# EAGLE design HexStepTroller_REV2auto (EAGLE 6.2)
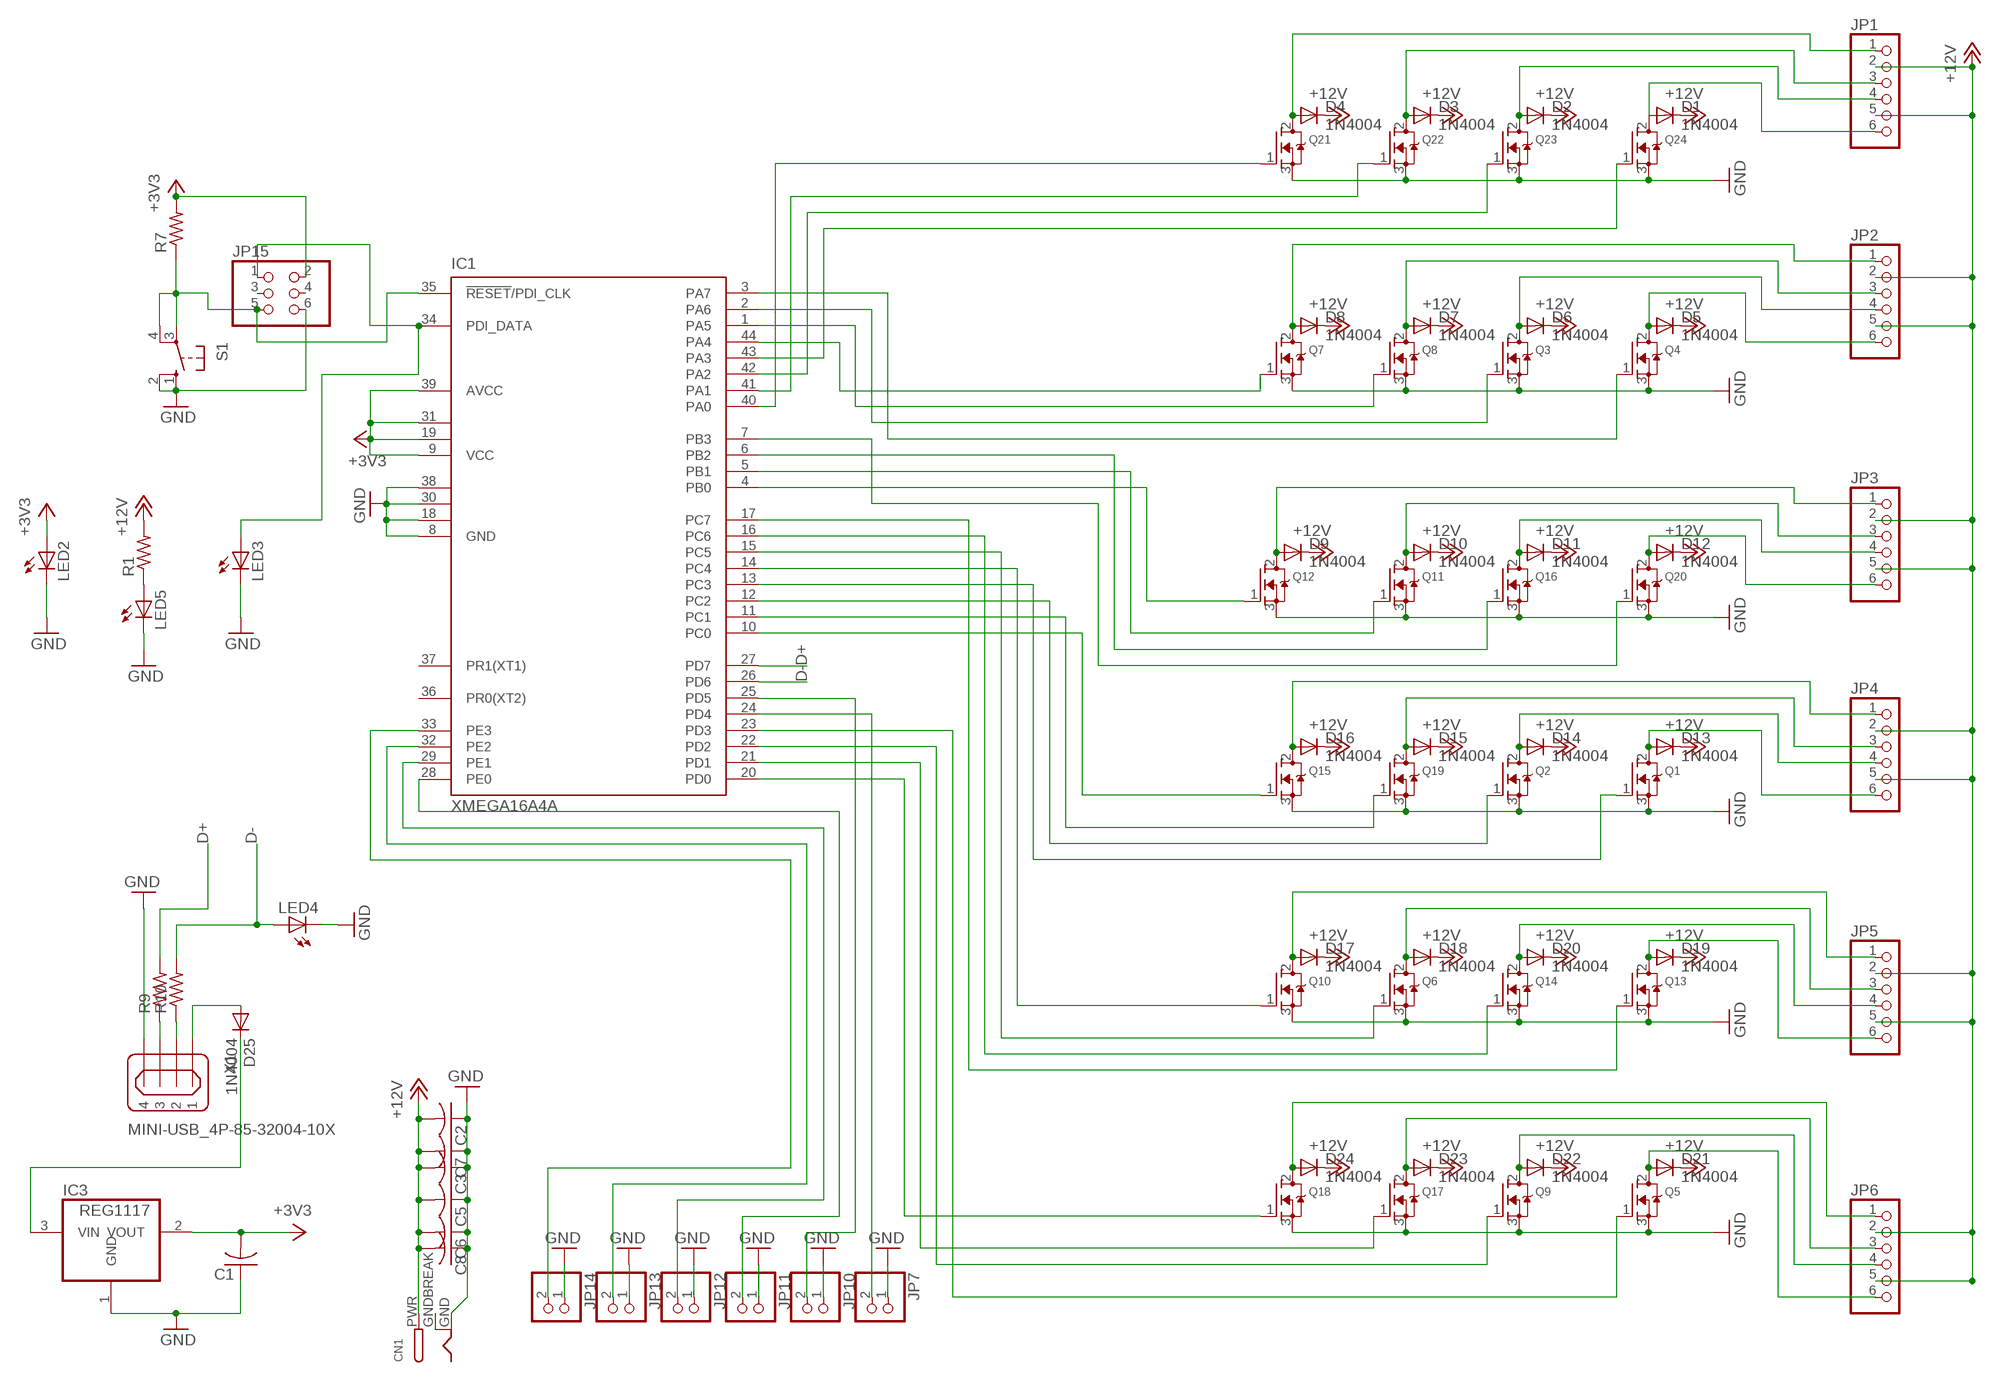
[diagram p0: schematic, sheet 1]

## Parts
C1  C-US050-075X075  [C050-075X075]
C2  C-US050-075X075  [C050-075X075]
C3  C-US050-075X075  [C050-075X075]
C5  C-US050-075X075  [C050-075X075]
C6  C-US050-075X075  [C050-075X075]
C7  C-US050-075X075  [C050-075X075]
C8  C-US050-075X075  [C050-075X075]
CN1  DCBARRELPTH  [DCJACK_2MM_PTH]
D1  1N4004  [DO41-10]
D2  1N4004  [DO41-10]
D3  1N4004  [DO41-10]
D4  1N4004  [DO41-10]
D5  1N4004  [DO41-10]
D6  1N4004  [DO41-10]
D7  1N4004  [DO41-10]
D8  1N4004  [DO41-10]
D9  1N4004  [DO41-10]
D10  1N4004  [DO41-10]
D11  1N4004  [DO41-10]
D12  1N4004  [DO41-10]
D13  1N4004  [DO41-10]
D14  1N4004  [DO41-10]
D15  1N4004  [DO41-10]
D16  1N4004  [DO41-10]
D17  1N4004  [DO41-10]
D18  1N4004  [DO41-10]
D19  1N4004  [DO41-10]
D20  1N4004  [DO41-10]
D21  1N4004  [DO41-10]
D22  1N4004  [DO41-10]
D23  1N4004  [DO41-10]
D24  1N4004  [DO41-10]
D25  1N4004  [DO41-10]
IC1  XMEGA16A4A  [TQFP44]
IC3  REG1117  [SOT223]
JP1  PINHD-1X6  [1X06]
JP2  PINHD-1X6  [1X06]
JP3  PINHD-1X6  [1X06]
JP4  PINHD-1X6  [1X06]
JP5  PINHD-1X6  [1X06]
JP6  PINHD-1X6  [1X06]
JP7  PINHD-1X2  [1X02]
JP10  PINHD-1X2  [1X02]
JP11  PINHD-1X2  [1X02]
JP12  PINHD-1X2  [1X02]
JP13  PINHD-1X2  [1X02]
JP14  PINHD-1X2  [1X02]
JP15  PINHD-2X3  [2X03]
LED2  LED5MM  [LED5MM]
LED3  LED5MM  [LED5MM]
LED4  LED5MM  [LED5MM]
LED5  LED5MM  [LED5MM]
Q1  MOSFET-NGDS_TO220V  [TO220V]
Q2  MOSFET-NGDS_TO220V  [TO220V]
Q3  MOSFET-NGDS_TO220V  [TO220V]
Q4  MOSFET-NGDS_TO220V  [TO220V]
Q5  MOSFET-NGDS_TO220V  [TO220V]
Q6  MOSFET-NGDS_TO220V  [TO220V]
Q7  MOSFET-NGDS_TO220V  [TO220V]
Q8  MOSFET-NGDS_TO220V  [TO220V]
Q9  MOSFET-NGDS_TO220V  [TO220V]
Q10  MOSFET-NGDS_TO220V  [TO220V]
Q11  MOSFET-NGDS_TO220V  [TO220V]
Q12  MOSFET-NGDS_TO220V  [TO220V]
Q13  MOSFET-NGDS_TO220V  [TO220V]
Q14  MOSFET-NGDS_TO220V  [TO220V]
Q15  MOSFET-NGDS_TO220V  [TO220V]
Q16  MOSFET-NGDS_TO220V  [TO220V]
Q17  MOSFET-NGDS_TO220V  [TO220V]
Q18  MOSFET-NGDS_TO220V  [TO220V]
Q19  MOSFET-NGDS_TO220V  [TO220V]
Q20  MOSFET-NGDS_TO220V  [TO220V]
Q21  MOSFET-NGDS_TO220V  [TO220V]
Q22  MOSFET-NGDS_TO220V  [TO220V]
Q23  MOSFET-NGDS_TO220V  [TO220V]
Q24  MOSFET-NGDS_TO220V  [TO220V]
R1  R-US_0204/7  [0204/7]
R7  R-US_0204/7  [0204/7]
R9  R-US_0204/7  [0204/7]
R10  R-US_0204/7  [0204/7]
S1  10-XX  [B3F-10XX]
X1  MINI-USB_4P-85-32004-10X  [85-32004-10X]

## Nets
+3V3: C1.2 IC1.9(VCC) IC1.19(VCC1) IC1.31(VCC2) IC1.39(AVCC) IC3.2(VOUT) JP15.2 LED2.A R7.2
+12V: C2.2 C3.2 C5.2 C6.2 C7.2 C8.2 CN1.PWR D1.C D2.C D3.C D4.C D5.C D6.C D7.C D8.C D9.C D10.C D11.C D12.C D13.C D14.C D15.C D16.C D17.C D18.C D19.C D20.C D21.C D22.C D23.C D24.C JP1.2 JP1.5 JP2.2 JP2.5 JP3.2 JP3.5 JP4.2 JP4.5 JP5.2 JP5.5 JP6.2 JP6.5 R1.2
D+: IC1.27(PD7) R9.2
D-: IC1.26(PD6) LED4.A R10.2
GND: C1.1 C2.1 C3.1 C5.1 C6.1 C7.1 C8.1 CN1.GND IC1.8(GND) IC1.18(GND1) IC1.30(GND2) IC1.38(GND3) IC3.1(GND) JP7.1 JP10.1 JP11.1 JP12.1 JP13.1 JP14.1 JP15.6 LED2.K(C) LED3.K(C) LED4.K(C) LED5.K(C) Q1.3(S) Q2.3(S) Q3.3(S) Q4.3(S) Q5.3(S) Q6.3(S) Q7.3(S) Q8.3(S) Q9.3(S) Q10.3(S) Q11.3(S) Q12.3(S) Q13.3(S) Q14.3(S) Q15.3(S) Q16.3(S) Q17.3(S) Q18.3(S) Q19.3(S) Q20.3(S) Q21.3(S) Q22.3(S) Q23.3(S) Q24.3(S) S1.1(S) S1.2(S1) X1.4
N$1: D1.A JP1.6 Q24.2(D)
N$2: D2.A JP1.4 Q23.2(D)
N$3: D3.A JP1.3 Q22.2(D)
N$4: D4.A JP1.1 Q21.2(D)
N$5: D5.A JP2.6 Q4.2(D)
N$6: D6.A JP2.4 Q3.2(D)
N$7: D7.A JP2.3 Q8.2(D)
N$8: D8.A JP2.1 Q7.2(D)
N$9: D9.A JP3.1 Q12.2(D)
N$10: D10.A JP3.3 Q11.2(D)
N$11: D11.A JP3.4 Q16.2(D)
N$12: D12.A JP3.6 Q20.2(D)
N$13: D13.A JP4.6 Q1.2(D)
N$14: D14.A JP4.4 Q2.2(D)
N$15: D15.A JP4.3 Q19.2(D)
N$16: D16.A JP4.1 Q15.2(D)
N$17: D17.A JP5.1 Q10.2(D)
N$18: D18.A JP5.3 Q6.2(D)
N$19: D19.A JP5.6 Q13.2(D)
N$20: D20.A JP5.4 Q14.2(D)
N$21: D21.A JP6.6 Q5.2(D)
N$22: D22.A JP6.4 Q9.2(D)
N$23: D23.A JP6.3 Q17.2(D)
N$24: D24.A JP6.1 Q18.2(D)
N$25: IC1.44(PA4) Q7.1(G)
N$26: IC1.25(PD5) JP10.2
N$27: IC1.28(PE0) JP11.2
N$28: LED5.A R1.1
N$29: IC1.32(PE2) JP13.2
N$30: IC1.33(PE3) JP14.2
N$32: IC1.35(!RESET!/PDI_CLK) JP15.5 R7.1 S1.3(P) S1.4(P1)
N$33: D25.C IC3.3(VIN)
N$34: R9.1 X1.3
N$35: D25.A X1.1
N$36: IC1.34(PDI_DATA) JP15.1 LED3.A
N$40: IC1.24(PD4) JP7.2
N$41: IC1.29(PE1) JP12.2
N$42: R10.1 X1.2
N$49: IC1.40(PA0) Q21.1(G)
N$50: IC1.41(PA1) Q22.1(G)
N$51: IC1.42(PA2) Q23.1(G)
N$52: IC1.43(PA3) Q24.1(G)
N$54: IC1.1(PA5) Q8.1(G)
N$55: IC1.2(PA6) Q3.1(G)
N$56: IC1.3(PA7) Q4.1(G)
N$57: IC1.4(PB0) Q12.1(G)
N$58: IC1.5(PB1) Q11.1(G)
N$59: IC1.6(PB2) Q16.1(G)
N$60: IC1.7(PB3) Q20.1(G)
N$61: IC1.10(PC0) Q15.1(G)
N$62: IC1.11(PC1) Q19.1(G)
N$63: IC1.12(PC2) Q2.1(G)
N$64: IC1.13(PC3) Q1.1(G)
N$65: IC1.14(PC4) Q10.1(G)
N$66: IC1.15(PC5) Q6.1(G)
N$67: IC1.16(PC6) Q14.1(G)
N$68: IC1.17(PC7) Q13.1(G)
N$69: IC1.20(PD0) Q18.1(G)
N$70: IC1.21(PD1) Q17.1(G)
N$71: IC1.22(PD2) Q9.1(G)
N$72: IC1.23(PD3) Q5.1(G)
Unconnected: IC1.36(PR0(XT2)) IC1.37(PR1(XT1)) JP15.3 JP15.4

## Power pins joined to a net without a drawn wire
GNDBREAK: CN1.GNDBREAK

## Library data of the parts
C1-C3 C5-C8 = resistor:C-US: CAPACITOR, American symbol
CN1 = adafruit:DCBARREL: 2.0mm DC Barrel Jack DCJACK_2MM_PTH - Through Hole Jack (4UConnector: 05537)
D1-D25 = adafruit:1N4004: DIODE General purpose 1N400x type rectifier (With bigger pads) http://www.ladyada.net/library/pcb/eaglelibrary.html
IC1 = atmel:XMEGA16A4: MICROCONTROLLER Features High-performance, Low-power 8/16-bit AVR XMEGA Microcontroller Non-Volatile Program and Data Memories - 16 KB - 128 KB of In-System Self-Programmable Flash - 4 KB - 8 KB Boot Code Section with Independent Lock Bits - 1 KB - 2 KB EEPROM - 2 KB - 8 KB Internal SRAM Peripheral Features - Four-channel DMA Controller with support for external requests - Eight-channel Event System - Five 16-bit Timer/Counters Three Timer/Counters with 4 Output Compare or Input Capture channels Two Timer/Counters with 2 Output Compare or Input Capture channels High-Resolution Extensions on all Timer/Counters Advanced Waveform Extension on one Timer/Counter - Five USARTs IrDA Extension on one USART - Two Two-Wire Interfaces with dual address match (I2C and SMBus compatible) - Two SPIs (Serial Peripheral Interfaces) peripherals - AES and DES Crypto Engine - 16-bit Real Time Counter with Separate Oscillator - One Twelve-channel, 12-bit, 2 Msps Analog to Digital Converter - One Two-channel, 12-bit, 1 Msps Digital to Analog Converter - Two Analog Comparators with Window compare function - External Interrupts on all General Purpose I/O pins - Programmable Watchdog Timer with Separate On-chip Ultra Low Power Oscillator Special Microcontroller Features - Power-on Reset and Programmable Brown-out Detection - Internal and External Clock Options with PLL - Programmable Multi-level Interrupt Controller - Sleep Modes: Idle, Power-down, Standby, Power-save, Extended Standby - Advanced Programming, Test and Debugging Interfaces PDI (Program and Debug Interface) for programming, test and debugging I/O and Packages - 34 Programmable I/O Lines - 44 - lead TQFP - 44 - pad VQFN/QFN - 49 - ball VFBGA Operating Voltage - 1.6 - 3.6V Speed performance - 0 - 12 MHz @ 1.6 - 3.6V - 0 - 32 MHz @ 2.7 - 3.6V Drawn by Dipl.-Ing. (FH) Robert Siegler Created: 27.05.09; OC_FARNELL: unknown; OC_NEWARK: unknown
IC3 = burr-brown:REG1117: 800mA and 1A Low Dropout (LDO) Positive Regulator 1.8V, 2.5V, 2.85V, 3.3V, 5V, and Adj; MPN: REG1117; OC_FARNELL: 1097566; OC_NEWARK: 14P6981
JP1-JP6 = pinhead:PINHD-1X6: PIN HEADER
JP7 JP10-JP14 = pinhead:PINHD-1X2: PIN HEADER
JP15 = pinhead:PINHD-2X3: PIN HEADER
LED2-LED5 = adafruit:LED: LED OSRAM: - CHIPLED LG R971, LG N971, LY N971, LG Q971, LY Q971, LO R971, LY R971 LH N974, LH R974 LS Q976, LO Q976, LY Q976 LO Q996 - Hyper CHIPLED LW Q18S LB Q993, LB Q99A, LB R99A - SideLED LS A670, LO A670, LY A670, LG A670, LP A670 LB A673, LV A673, LT A673, LW A673 LH A674 LY A675 LS A676, LA A676, LO A676, LY A676, LW A676 LS A679, LY A679, LG A679 - Hyper Micro SIDELED® LS Y876, LA Y876, LO Y876, LY Y876 LT Y87S - SmartLED LW L88C, LW L88S LB L89C, LB L89S, LG L890 LS L89K, LO L89K, LY L89K LS L896, LA L896, LO L896, LY L896 - TOPLED LS T670, LO T670, LY T670, LG T670, LP T670 LSG T670, LSP T670, LSY T670, LOP T670, LYG T670 LG T671, LOG T671, LSG T671 LB T673, LV T673, LT T673, LW T673 LH T674 LS T676, LA T676, LO T676, LY T676, LB T676, LH T676, LSB T676, LW T676 LB T67C, LV T67C, LT T67C, LS T67K, LO T67K, LY T67K, LW E67C LS E67B, LA E67B, LO E67B, LY E67B, LB E67C, LV E67C, LT E67C LW T67C LS T679, LY T679, LG T679 LS T770, LO T770, LY T770, LG T770, LP T770 LB T773, LV T773, LT T773, LW T773 LH T774 LS E675, LA E675, LY E675, LS T675 LS T776, LA T776, LO T776, LY T776, LB T776 LHGB T686 LT T68C, LB T68C - Hyper Mini TOPLED® LB M676 - Mini TOPLED Santana® LG M470 LS M47K, LO M47K, LY M47K Source: http://www.osram.convergy.de/
Q1-Q24 = adafruit:MOSFET-N: N-Channel Mosfet 2N7002E - 60V 260mA SOT23 [Digikey: 2N7002ET1GOSTR-ND] - REEL BSH103 - 30V 850mA SOT23 [Digikey: 568-5013-1-ND]
R1 R7 R9 R10 = resistor:R-US_: RESISTOR, American symbol
S1 = switch-omron:10-XX: OMRON SWITCH; MPN: B3F-1000; OC_FARNELL: 176432; OC_NEWARK: 36M3542
X1 = con-cypressindustries:MINI-USB_4P-: MINI USB 4 Pol. Source: www.cypressindustries.com; OC_FARNELL: unknown; OC_NEWARK: unknown

## Net classes
0 default: width 0.305 mm, drill 0.508 mm, clearance 0.254 mm
1 power: width 0.61 mm, drill 0.508 mm, clearance 0.254 mm

## Board
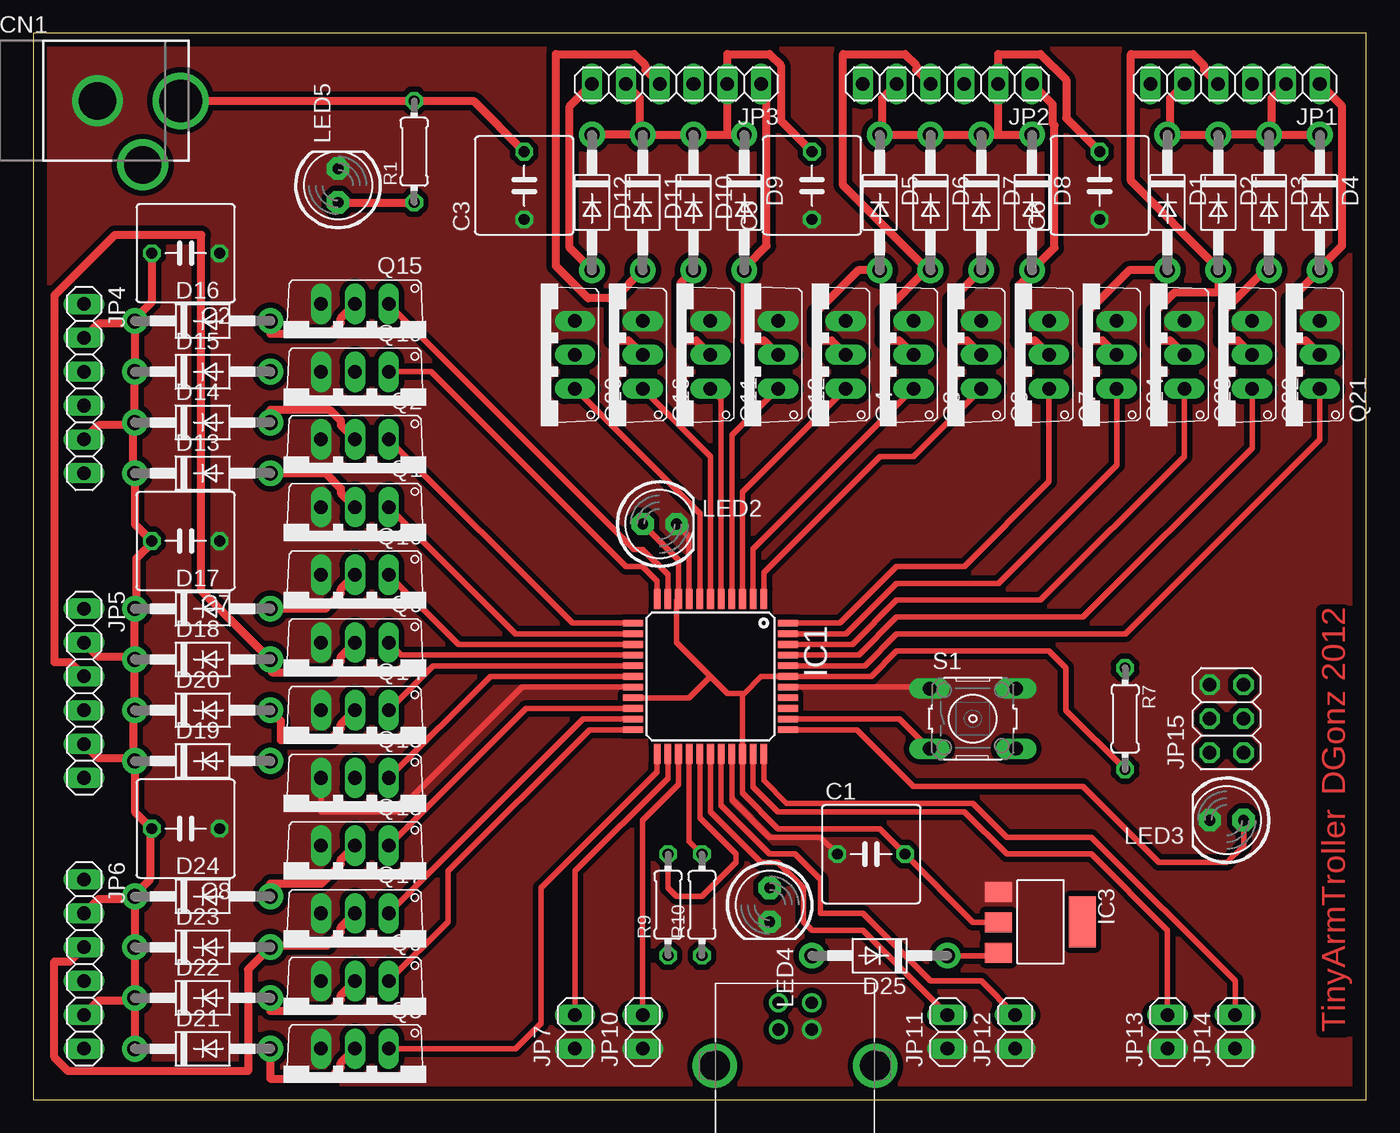
[diagram p1: board, top side]
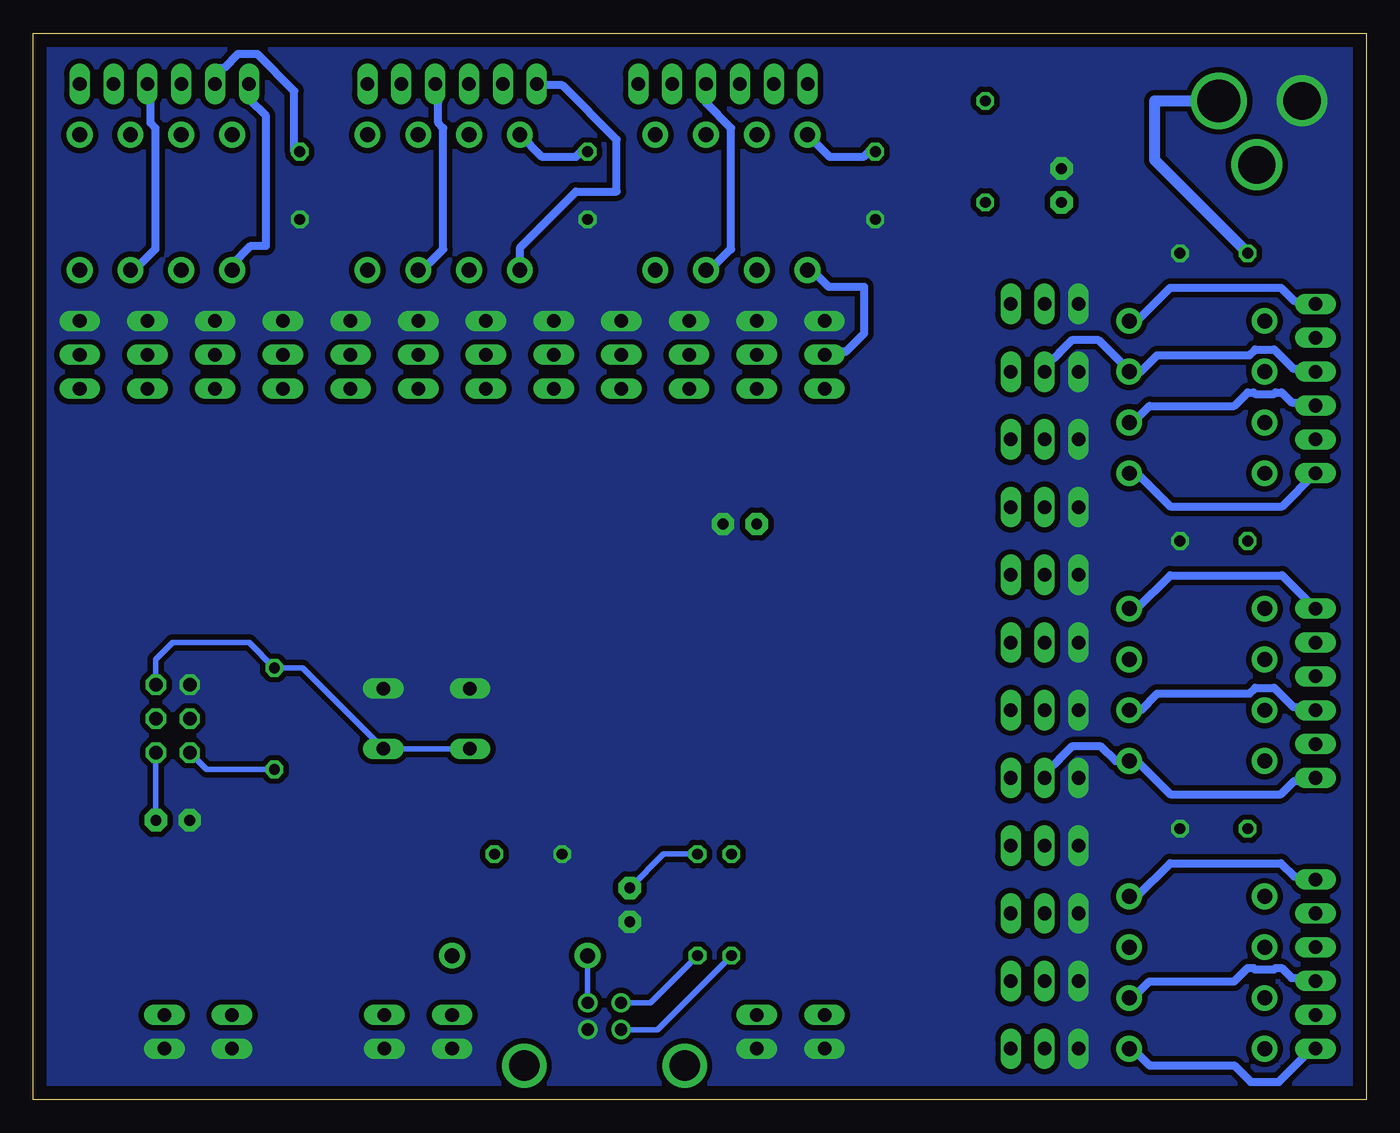
[diagram p2: board, bottom side, seen from below]

Size 100 x 80 mm. Coordinates in mm from the lower left corner, seen from the top.
Outline: 0,0 100,0 100,80 0,80 0,0
Copper layers (1*16): Top 0.035mm / dielectric 1.5mm / Bottom 0.035mm
Design rules: minimum track width 24mil, minimum drill 24mil, track to track 16mil, track to pad 16mil, pad to pad 16mil, via to via 16mil, smd to smd 12mil, copper to edge 40mil, drill to drill 12mil, minimum pad ring 10mil, minimum via ring 8mil, stop-mask expansion 4mil, vias tented up to drill 0mil, thermal gap 12mil

### Footprints (pad centres in the part's own frame; a part is rotated, then mirrored left to right if it is on the bottom)
C050-075X075 = drill 0.813 octagon: 1 -2.54,0; 2 2.54,0
DCJACK_2MM_PTH = drill 2.8: GND 0,7.35; GNDBREAK 4.8,10.75 | drill 3.2: PWR 0,13.6
DO41-10 = drill 1.118 pad 1.93: A 5.08,0; C -5.08,0
TQFP44 = smd 1.5 x 0.5: 1 -5.8,4; 2 -5.8,3.2; 3 -5.8,2.4; 4 -5.8,1.6; 5 -5.8,0.8; 6 -5.8,0; 7 -5.8,-0.8; 8 -5.8,-1.6; 9 -5.8,-2.4; 10 -5.8,-3.2; 11 -5.8,-4; 23 5.8,-4; 24 5.8,-3.2; 25 5.8,-2.4; 26 5.8,-1.6; 27 5.8,-0.8; 28 5.8,0; 29 5.8,0.8; 30 5.8,1.6; 31 5.8,2.4; 32 5.8,3.2; 33 5.8,4 | smd 0.5 x 1.5: 12 -4,-5.8; 13 -3.2,-5.8; 14 -2.4,-5.8; 15 -1.6,-5.8; 16 -0.8,-5.8; 17 0,-5.8; 18 0.8,-5.8; 19 1.6,-5.8; 20 2.4,-5.8; 21 3.2,-5.8; 22 4,-5.8; 34 4,5.8; 35 3.2,5.8; 36 2.4,5.8; 37 1.6,5.8; 38 0.8,5.8; 39 0,5.8; 40 -0.8,5.8; 41 -1.6,5.8; 42 -2.4,5.8; 43 -3.2,5.8; 44 -4,5.8
SOT223 = smd 1.499 x 2.007: 1 -2.261,-3.15; 2 0.025,-3.15; 3 2.311,-3.15 | smd 3.81 x 2.007: 4 0,3.15
1X06 = drill 1.016 long: 1 -6.35,0; 2 -3.81,0; 3 -1.27,0; 4 1.27,0; 5 3.81,0; 6 6.35,0
1X02 = drill 1.016 long: 1 -1.27,0; 2 1.27,0
2X03 = drill 1.016 octagon: 1 -2.54,-1.27; 2 -2.54,1.27; 3 0,-1.27; 4 0,1.27; 5 2.54,-1.27; 6 2.54,1.27
LED5MM = drill 0.813 pad 1.676 octagon: A -1.27,0; K 1.27,0
TO220V = drill 1.016 long: 1 -2.54,-2.54; 2 0,-2.54; 3 2.54,-2.54
0204/7 = drill 0.813 octagon: 1 -3.81,0; 2 3.81,0
B3F-10XX = drill 1.016 long: 1 -3.251,2.261; 2 3.251,2.261; 3 -3.251,-2.261; 4 3.251,-2.261
85-32004-10X = drill 0.92 pad 1.27: 1 4.71,-1.25; 2 4.71,1.25; 3 2.71,1.25; 4 2.71,-1.25 | drill 2.3 pad 3: M1 0,6.02; M2 0,-6.02

### Placement (x,y rotation side)
C1  62.87,18.41 0 top
C2  11.43,63.5 180 top
C3  36.83,68.58 90 top
C5  58.42,68.58 90 top
C6  80.01,68.58 90 top
C7  11.43,41.91 180 top
C8  11.43,20.32 180 top
CN1  -2.54,74.93 270 top
D1  85.09,67.31 270 top
D2  88.9,67.31 270 top
D3  92.71,67.31 270 top
D4  96.52,67.31 270 top
D5  63.5,67.31 270 top
D6  67.31,67.31 270 top
D7  71.12,67.31 270 top
D8  74.93,67.31 270 top
D9  53.34,67.31 270 top
D10  49.53,67.31 270 top
D11  45.72,67.31 270 top
D12  41.91,67.31 270 top
D13  12.7,46.99 0 top
D14  12.7,50.8 0 top
D15  12.7,54.61 0 top
D16  12.7,58.42 0 top
D17  12.7,36.83 0 top
D18  12.7,33.02 0 top
D19  12.7,25.4 0 top
D20  12.7,29.21 0 top
D21  12.7,3.81 0 top
D22  12.7,7.62 0 top
D23  12.7,11.43 0 top
D24  12.7,15.24 0 top
D25  63.5,10.79 180 top
IC1  50.8,31.75 270 top
IC3  75.56,13.34 270 top
JP1  90.17,76.2 180 top
JP2  68.58,76.2 180 top
JP3  48.26,76.2 180 top
JP4  3.81,53.34 270 top
JP5  3.81,30.48 270 top
JP6  3.81,10.16 270 top
JP7  40.64,5.08 90 top
JP10  45.72,5.08 90 top
JP11  68.58,5.08 90 top
JP12  73.66,5.08 90 top
JP13  85.09,5.08 90 top
JP14  90.17,5.08 90 top
JP15  89.53,28.57 90 top
LED2  46.99,43.18 0 top
LED3  89.53,20.95 180 top
LED4  55.24,14.61 270 top
LED5  22.86,68.58 90 top
Q1  24.13,41.91 180 top
Q2  24.13,46.99 180 top
Q3  63.5,55.88 90 top
Q4  58.42,55.88 90 top
Q5  24.13,1.27 180 top
Q6  24.13,31.75 180 top
Q7  73.66,55.88 90 top
Q8  68.58,55.88 90 top
Q9  24.13,6.35 180 top
Q10  24.13,36.83 180 top
Q11  48.26,55.88 90 top
Q12  53.34,55.88 90 top
Q13  24.13,21.59 180 top
Q14  24.13,26.67 180 top
Q15  24.13,57.15 180 top
Q16  43.18,55.88 90 top
Q17  24.13,11.43 180 top
Q18  24.13,16.51 180 top
Q19  24.13,52.07 180 top
Q20  38.1,55.88 90 top
Q21  93.98,55.88 90 top
Q22  88.9,55.88 90 top
Q23  83.82,55.88 90 top
Q24  78.74,55.88 90 top
R1  28.57,71.12 90 top
R7  81.92,28.57 270 top
R9  47.62,14.61 90 top
R10  50.16,14.61 90 top
S1  70.48,28.57 0 top
X1  57.15,2.54 90 top

### Tracks (layer width: path | path; a pad name or v marks a point on that pad's centre or on a via)
+3V3
  Top 0.406: IC3.2 70.51,13.31 C1.2 63.5,20.32 55.88,20.32 53.2,23 IC1.31 53.2,30.34 53.34,30.48 | 53.34,30.48 54.61,31.75 IC1.39 62.87,31.75 64.77,33.66 76.2,33.66 77.47,32.38 77.47,29.21 R7.2 | 53.34,30.48 52.07,30.48 50.8,31.75 | 50.8,31.75 48.26,34.29 48.26,37.41 IC1.9 48.4,40.5 LED2.A | IC1.19 49.2,30.15 50.8,31.75
  Bottom 0.406: JP15.2 87,24.77 R7.2
+12V
  Top 0.61: JP4.2 4.88,58.22 7.62,58.22 D16.C | D16.C D15.C D14.C | JP4.5 4.88,50.6 7.62,50.6 D14.C | D14.C 7.49,50.32 7.49,47.27 D13.C 7.62,43.18 C7.2 8.76,41.63 7.75,40.62 7.75,37.11 D17.C D18.C | JP6.5 4.88,7.42 7.62,7.42 D22.C | D22.C D21.C | JP6.2 4.88,15.04 7.62,15.04 D24.C | D24.C D23.C D22.C | JP5.2 4.88,33.22 7.62,33.22 D18.C | D19.C 7.62,21.59 C8.2 8.76,20.04 8.76,16.54 7.75,15.52 D24.C | JP5.5 4.88,25.6 7.42,25.6 D19.C | D19.C 7.54,25.88 7.54,29.13 D20.C D18.C | JP1.5 85.29,75.13 85.29,72.59 D1.C D2.C D3.C | JP1.2 92.91,75.13 92.91,72.59 D3.C | D3.C D4.C | C6.2 77.5,73.64 77.5,76.5 75.56,78.44 72.39,78.44 JP2.2 72.39,72.39 | JP2.5 63.7,75.13 63.7,72.59 D5.C D6.C D7.C 72.39,72.39 | 72.39,72.39 D8.C | C5.2 56.08,73.46 56.08,77.6 55.24,78.44 52.07,78.44 JP3.2 52.07,72.39 | JP3.5 45.52,75.13 45.52,72.59 D11.C | D12.C 45.24,72.39 45.24,72.47 D11.C | D11.C D10.C 52.07,72.39 | 52.07,72.39 D9.C | C3.2 33.02,74.93 R1.2 CN1.PWR | C2.2 8.89,59.84 7.75,58.7 D16.C
  Bottom 0.61: JP1.5 86.36,77.39 85.7,77.39 84.66,78.44 83.19,78.44 80.42,75.67 80.42,71.12 C6.2 | D12.C 40.23,70.71 37.72,70.71 37.31,71.12 C3.2 | D5.C 61.82,70.71 59.31,70.71 58.9,71.12 C5.2
  Bottom 0.813: C2.2 15.88,70.48 15.88,74.93 CN1.PWR
D+
  Top 0.406: IC1.27 50,21.12 52.7,18.41 52.7,17.78 50.16,15.24 48.26,15.24 47.62,15.88 R9.2
D-
  Top 0.406: IC1.26 49.2,19.38 R10.2
  Bottom 0.406: LED4.A 52.7,18.41 R10.2
GND
  Top 0.406: IC1.8 49.2,42.24 LED2.K | IC1.38 67.12,30.95 S1.1 | IC1.18 36.66,30.95 27.3,21.59 21.59,21.59 Q13.3 | IC1.30 52.4,22.53 55.24,19.68 59.05,19.68 C1.1
  pour Bottom (no thermals): 0,80.01 100.33,80.01 100.33,0 0,0
  pour Top (no thermals): 0,80.01 100.33,80.01 100.33,0 0,0
N$1
  Top 0.61: Q24.2 80.21,56.95 79.05,56.95 79.05,59.05 82.22,62.23 D1.A
  Bottom 0.61: JP1.6 83.82,74.98 83.72,74.98 82.55,73.81 82.55,64.06 83.69,64.06 85.09,62.66 D1.A
N$2
  Top 0.61: Q23.2 85.29,56.95 84.12,56.95 84.12,59.05 85.62,60.55 88.9,60.55 D2.A 88.77,62.51 82.35,68.94 82.35,78.44 87,78.44 87.83,77.6 87.83,77.27 JP1.4
N$3
  Top 0.61: Q22.2 90.37,56.95 89.2,56.95 89.2,59.05 92.38,62.23 D3.A
  Bottom 0.61: JP1.3 91.44,74.98 91.34,74.98 91.21,74.85 91.21,73.28 90.83,72.9 90.83,63.8 90.86,63.8 92.43,62.23 D3.A
N$4
  Top 0.61: Q21.2 95.45,56.95 94.28,56.95 94.28,59.99 D4.A 96.65,62.51 98.2,64.06 98.2,74.52 JP1.1
N$5
  Top 0.61: Q4.2 59.89,56.95 58.73,56.95 58.73,59.05 61.9,62.23 D5.A
  Bottom 0.61: JP2.6 62.13,76.1 60.3,76.1 56.24,72.03 56.24,68.12 59.28,68.12 63.48,63.93 63.48,62.23 D5.A
N$6
  Top 0.61: Q3.2 64.97,56.95 63.8,56.95 63.8,59.05 66.98,62.23 D6.A 66.85,62.51 60.76,68.61 60.76,78.44 65.41,78.44 66.24,77.6 66.24,77.27 JP2.4
N$7
  Top 0.61: Q8.2 70.05,56.95 68.89,56.95 68.89,59.99 D7.A
  Bottom 0.61: JP2.3 69.85,74.98 69.75,74.98 69.62,74.85 69.62,73.28 69.24,72.9 69.24,63.8 69.27,63.8 70.84,62.23 D7.A
N$8
  Top 0.61: JP2.1 76.48,74.65 76.48,73.23 76.61,73.1 76.61,63.91 D8.A 74.8,61.95 73.97,61.11 73.97,56.95 75.13,56.95 Q7.2
N$9
  Top 0.61: Q12.2 54.81,56.95 53.34,56.95 D9.A 53.47,62.51 55.02,64.06 55.02,75.79 JP3.1
N$10
  Top 0.61: Q11.2 49.73,56.95 48.56,56.95 48.56,61.27 D10.A
  Bottom 0.61: JP3.3 49.53,74.75 49.51,74.75 47.65,72.9 47.65,63.8 47.68,63.8 49.25,62.23 D10.A
N$11
  Top 0.61: Q16.2 44.65,56.95 43.48,56.95 43.48,59.99 | D11.A 43.48,59.99 | JP3.4 45.92,77.27 45.92,77.6 45.09,78.44 39.22,78.44 39.22,62.53 41.63,60.12 43.2,60.12 43.48,59.99
N$12
  Top 0.61: JP3.6 40.23,74.52 40.23,63.91 D12.A
  Bottom 0.61: Q20.2 40.41,56.11 39.04,56.11 37.67,57.48 37.67,60.98 40.34,60.98 41.58,62.23 D12.A
N$13
  Top 0.61: Q1.2 23.06,45.52 23.06,45.85 21.92,46.99 D13.A
  Bottom 0.61: JP4.6 6.3,44.5 14.71,44.5 17.2,46.99 D13.A
N$14
  Top 0.61: Q2.2 23.06,50.6 23.06,50.93 22.23,51.77 17.78,51.77 D14.A
  Bottom 0.61: JP4.4 4.04,52.3 5.59,52.3 6.35,53.06 6.78,53.06 6.91,52.93 8.33,52.93 8.46,53.06 8.89,53.06 9.91,52.05 16.26,52.05 17.5,50.8 D14.A
N$15
  Bottom 0.61: JP4.3 4.04,54.84 5.46,54.84 6.91,56.29 8.33,56.29 8.76,55.85 15.67,55.85 16.92,54.61 D15.A 17.93,54.86 17.96,54.86 20.07,56.97 22.1,56.97 22.99,56.08 22.99,56.03 23.42,55.6 24.13,55.6 Q19.2
N$16
  Top 0.61: Q15.2 23.06,58.62 23.06,58.29 22.23,57.45 17.78,57.45 D16.A
  Bottom 0.61: JP4.1 4.04,59.92 5.41,59.92 6.4,60.91 14.71,60.91 17.2,58.42 D16.A
N$17
  Top 0.61: Q10.2 23.06,38.3 23.06,37.97 21.92,36.83 D17.A
  Bottom 0.61: JP5.1 6.3,39.32 14.71,39.32 17.2,36.83 D17.A
N$18
  Top 0.61: JP5.3 2.74,32.82 1.57,32.82 1.57,60.33 6.12,64.87 12.6,64.87 12.6,38.2 D18.A 17.91,32.74 17.91,32.05 22.23,32.05 23.06,32.89 23.06,33.22 Q6.2
N$19
  Bottom 0.61: JP5.6 4.04,23.9 5.41,23.9 6.4,22.91 14.71,22.91 17.2,25.4 D19.A 18.8,25.4 19.89,26.49 22.1,26.49 22.99,25.6 22.99,25.55 23.42,25.12 24.13,25.12 Q13.2
N$20
  Top 0.61: Q14.2 23.06,28.14 23.06,27.81 22.23,26.98 18.57,26.98 18.57,28.42 D20.A
  Bottom 0.61: JP5.4 4.04,29.44 5.46,29.44 6.91,30.89 8.33,30.89 8.76,30.45 15.67,30.45 16.92,29.21 D20.A
N$21
  Top 0.61: Q5.2 23.06,2.74 23.06,2.41 22.23,1.57 17.78,1.57 D21.A
  Bottom 0.61: JP6.6 4.27,3.35 4.52,3.35 6.55,1.32 8.66,1.32 9.91,2.56 16.26,2.56 17.5,3.81 D21.A
N$22
  Top 0.61: Q9.2 23.06,7.82 23.06,7.49 22.23,6.66 17.78,6.66 D22.A
  Bottom 0.61: JP6.4 4.04,9.12 5.59,9.12 6.35,9.88 6.78,9.88 6.91,9.75 8.33,9.75 8.46,9.88 8.89,9.88 9.91,8.87 16.26,8.87 17.5,7.62 D22.A
N$23
  Top 0.61: JP6.3 2.74,10.36 1.57,10.36 1.57,3.17 2.62,2.13 16.1,2.13 16.1,9.75 D23.A 18.06,11.56 22.05,11.56 23.06,12.57 23.06,12.9 Q17.2
N$24
  Top 0.61: Q18.2 23.06,17.98 23.06,17.65 21.61,16.2 17.78,16.2 D24.A
  Bottom 0.61: JP6.1 4.04,16.74 5.41,16.74 6.4,17.73 14.71,17.73 17.2,15.24 D24.A
N$25
  Top 0.406: IC1.44 60.52,35.75 64.77,40.01 69.85,40.01 76.2,46.35 Q7.1
N$26
  Top 0.406: IC1.25 48.4,23.64 45.72,20.95 JP10.2
N$27
  Top 0.406: IC1.28 50.8,21.59 54.61,17.78 55.88,17.78 57.78,15.88 57.78,13.34 58.42,12.7 62.23,12.7 JP11.2
N$28
  Top 0.61: LED5.A R1.1
N$29
  Top 0.406: IC1.32 54,23.47 55.88,21.59 69.85,21.59 73.03,18.41 79.38,18.41 85.09,12.7 JP13.2
N$30
  Top 0.406: IC1.33 54.8,23.94 56.52,22.23 70.48,22.23 73.03,19.68 79.38,19.68 90.17,8.89 JP14.2
N$32
  Top 0.406: S1.3 65,28.55 IC1.35
  Bottom 0.406: JP15.5 90.81,33.02 89.53,34.29 83.82,34.29 R7.1 79.81,32.38 S1.4 S1.3
N$33
  Top 0.406: IC3.3 72.19,10.79 D25.C
N$34
  Bottom 0.406: X1.3 53.17,5.25 R9.1
N$35
  Bottom 0.406: X1.1 58.42,7.27 D25.A
N$36
  Top 0.406: IC1.34 61.78,27.75 66.04,23.5 78.74,23.5 84.45,17.78 89.53,17.78 90.81,19.05 LED3.A
  Bottom 0.406: JP15.1 LED3.A
N$40
  Top 0.406: IC1.24 47.6,24.11 40.64,17.14 JP7.2
N$41
  Top 0.406: IC1.29 51.6,22.06 55.24,18.41 57.15,18.41 59.05,16.51 59.05,13.97 62.23,13.97 67.31,8.89 71.12,8.89 JP12.2
N$42
  Bottom 0.406: X1.2 53.71,7.25 R10.1
N$49
  Top 0.406: IC1.40 62.4,32.55 64.77,34.92 81.92,34.92 96.52,49.53 Q21.1
N$50
  Top 0.406: IC1.41 61.92,33.35 64.77,36.2 78.74,36.2 91.44,48.9 Q22.1
N$51
  Top 0.406: IC1.42 61.45,34.15 64.77,37.47 75.56,37.47 86.36,48.26 Q23.1
N$52
  Top 0.406: IC1.43 60.98,34.95 64.77,38.73 72.39,38.73 81.28,47.62 Q24.1
N$54
  Top 0.406: IC1.1 54.8,39.56 63.5,48.26 66.04,48.26 Q8.1
N$55
  Top 0.406: IC1.2 54,41.3 Q3.1
N$56
  Top 0.406: IC1.3 53.2,45.58 Q4.1
N$57
  Top 0.406: IC1.4 52.4,49.86 Q12.1
N$58
  Top 0.406: IC1.5 51.6,52.54 Q11.1
N$59
  Top 0.406: IC1.6 50.8,48.26 Q16.1
N$60
  Top 0.406: IC1.7 50,43.98 Q20.1
N$61
  Top 0.406: IC1.10 47.6,39.4 45.72,41.27 45.09,41.27 Q15.1
N$62
  Top 0.406: IC1.11 46.8,38.92 45.72,40.01 44.45,40.01 29.84,54.61 Q19.1
N$63
  Top 0.406: IC1.12 40.45,35.75 Q2.1
N$64
  Top 0.406: IC1.13 36.17,34.95 Q1.1
N$65
  Top 0.406: IC1.14 31.89,34.15 Q10.1
N$66
  Top 0.406: IC1.15 27.61,33.35 Q6.1
N$67
  Top 0.406: IC1.16 30.01,32.55 Q14.1
N$68
  Top 0.406: IC1.17 34.29,31.75 Q13.1
N$69
  Top 0.406: IC1.20 36.97,29.35 Q18.1
N$70
  Top 0.406: IC1.21 41.25,28.55 Q17.1
N$71
  Top 0.406: IC1.22 41.72,27.75 31.11,17.14 31.11,13.34 Q9.1
N$72
  Top 0.406: IC1.23 46.8,24.57 38.1,15.88 38.1,5.71 36.2,3.81 Q5.1

### Text on the board
Top: DGonz 2012 | TinyArmTroller